# Altium schematic sheet Sensors_StreetLight.SchDoc: Smart Street Light System - Street Light Schematic Doc
size 431 x 279 mm; Author: Arvind Balaji Narayan, Gopik Anand; CompanyName: Cats_and_Dogs; Engineer: Arvind Balaji Narayan, Gopik Anand; Organization: University of Pennsylvania
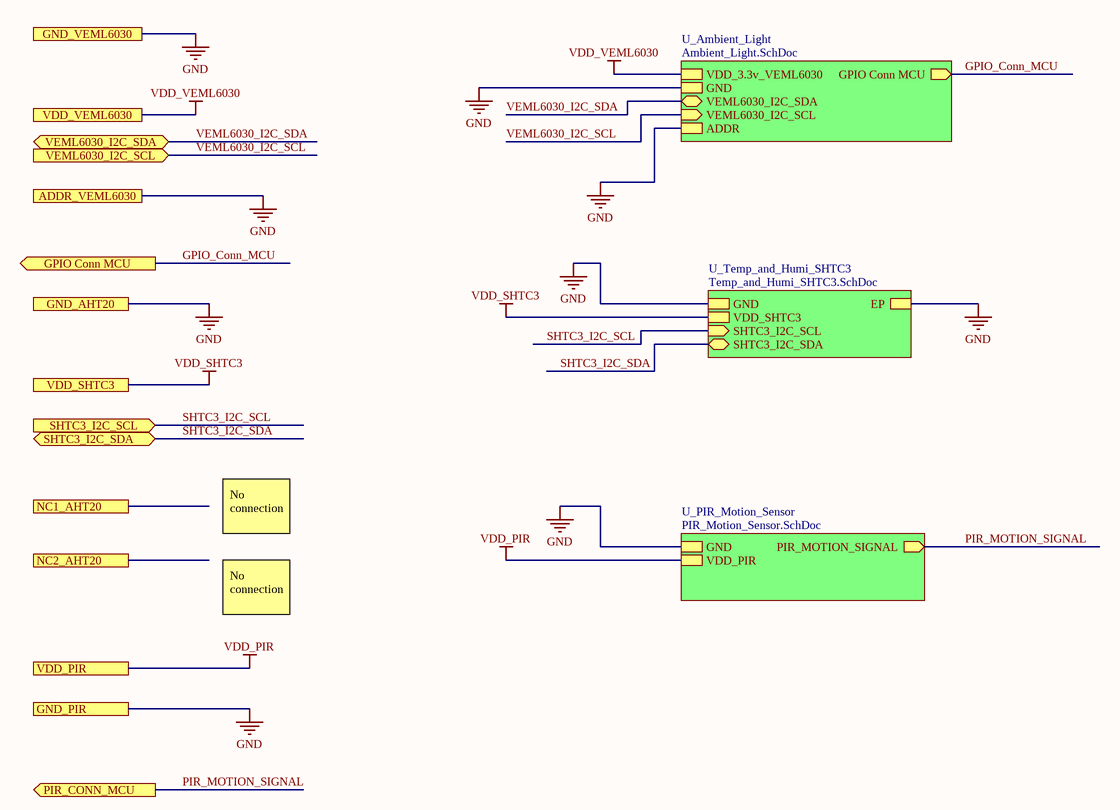
[diagram p0: Sensors_StreetLight.SchDoc]

## Sub-sheets
U_Ambient_Light = Ambient_Light.SchDoc: VDD_3.3v_VEML6030, GND, VEML6030_I2C_SDA (bidir), VEML6030_I2C_SCL (in), ADDR, GPIO Conn MCU (out)
U_PIR_Motion_Sensor = PIR_Motion_Sensor.SchDoc: GND, VDD_PIR, PIR_MOTION_SIGNAL (out)
U_Temp_and_Humi_SHTC3 = Temp_and_Humi_SHTC3.SchDoc: GND, VDD_SHTC3, SHTC3_I2C_SCL (in), SHTC3_I2C_SDA (bidir), EP

## Ports
ADDR_VEML6030, GND_AHT20, GND_PIR, GND_VEML6030, GPIO Conn MCU (out), NC1_AHT20, NC2_AHT20, PIR_CONN_MCU (out), SHTC3_I2C_SCL (in), SHTC3_I2C_SDA (bidir), VDD_PIR, VDD_SHTC3, VDD_VEML6030, VEML6030_I2C_SCL (in), VEML6030_I2C_SDA (bidir)

## Nets
GND: port ADDR_VEML6030, port GND_AHT20, port GND_VEML6030, port GND_PIR, sheet U_Ambient_Light/GND, sheet U_Ambient_Light/ADDR, sheet U_PIR_Motion_Sensor/GND, sheet U_Temp_and_Humi_SHTC3/GND, sheet U_Temp_and_Humi_SHTC3/EP
VDD_PIR: port VDD_PIR, sheet U_PIR_Motion_Sensor/VDD_PIR
VDD_SHTC3: port VDD_SHTC3, sheet U_Temp_and_Humi_SHTC3/VDD_SHTC3
VDD_VEML6030: port VDD_VEML6030, sheet U_Ambient_Light/VDD_3.3v_VEML6030
GPIO_Conn_MCU: port GPIO Conn MCU, sheet U_Ambient_Light/GPIO Conn MCU
PIR_MOTION_SIGNAL: port PIR_CONN_MCU, sheet U_PIR_Motion_Sensor/PIR_MOTION_SIGNAL
SHTC3_I2C_SCL: port SHTC3_I2C_SCL, sheet U_Temp_and_Humi_SHTC3/SHTC3_I2C_SCL
SHTC3_I2C_SDA: port SHTC3_I2C_SDA, sheet U_Temp_and_Humi_SHTC3/SHTC3_I2C_SDA
VEML6030_I2C_SCL: port VEML6030_I2C_SCL, sheet U_Ambient_Light/VEML6030_I2C_SCL
VEML6030_I2C_SDA: port VEML6030_I2C_SDA, sheet U_Ambient_Light/VEML6030_I2C_SDA

## Notes on the sheet
- No connection
- DWG. NO.
- REV.
- SHT.
- THIS DOCUMENT AND THE DATA DISCLOSED HEREIN OR HEREWITH IS THE PROPERTY OF ALTIUM LIMITED AND MAY BE FREELY DISTRIBUTED IN WHOLE. NO RIGHTS ARE RESERVED OR EXPRESS OR IMPLIED WARANTEE GIVEN.
- REVISION
- DESCRIPTION
- DATE
- APPROVED
- ENG:
- APPROVALS
- PROJECT
- DSN:
- CHK:
- REFERENCE DOCUMENTS
- PROJECT REVISION:
- TITLE
- DOCUMENT REVISION:
- DESIGN ITEM:
- BOM:
- FAB DWG:
- PCB DWG:
- ASSY DWG:
- SCALE:
- SIZE
- B
- CAGE CODE
- FILE NAME
- DWG NO.
- SHEET
- OF
- REV